# EAGLE schematic Step-to-TalkV2 (EAGLE 8.2.2)
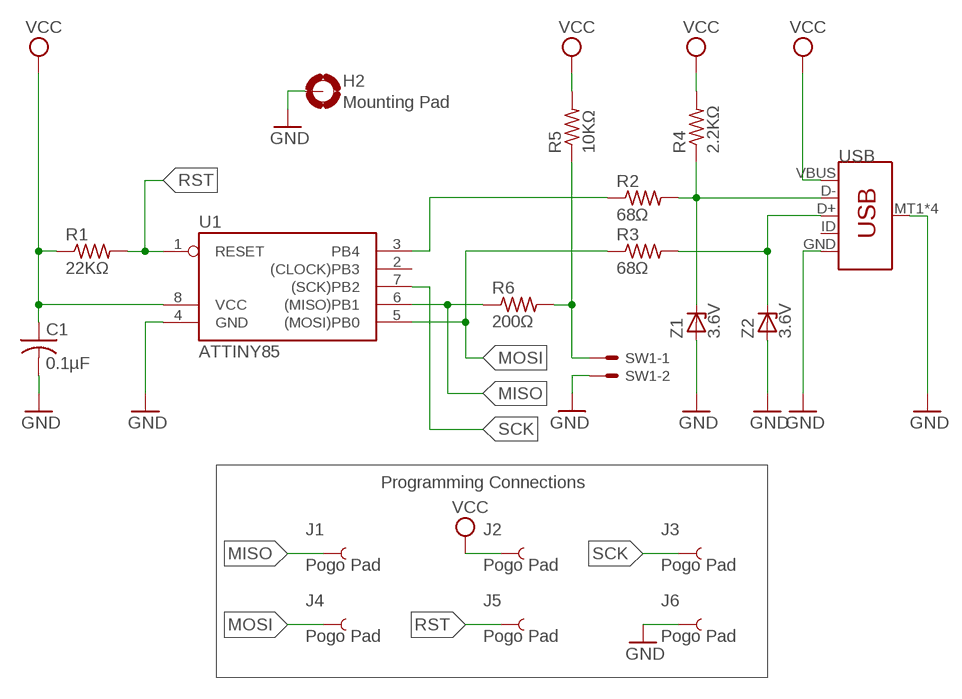
[diagram p0: schematic, sheet 1]

## Parts
C1  0.1µF  C-USC0603  [C0603]
H2  Mounting Pad  MOUNT-PAD-ROUND4.3  [4,3-PAD]
J1  Pogo Pad  TEST-POINT3  [PAD.03X.03]
J2  Pogo Pad  TEST-POINT3  [PAD.03X.03]
J3  Pogo Pad  TEST-POINT3  [PAD.03X.03]
J4  Pogo Pad  TEST-POINT3  [PAD.03X.03]
J5  Pogo Pad  TEST-POINT3  [PAD.03X.03]
J6  Pogo Pad  TEST-POINT3  [PAD.03X.03]
R1  22KΩ  R-US_R0603  [R0603]
R2  68Ω  R-US_R0603  [R0603]
R3  68Ω  R-US_R0603  [R0603]
R4  2.2KΩ  R-US_R0603  [R0603]
R5  10KΩ  R-US_R0603  [R0603]
R6  200Ω  R-US_R0603  [R0603]
SW1  87438-02  [87438-02]
U1  ATTINY85  TINY22S  [SOIC8]
USB  USB_MICRO-B_SMT  [USB-MICROB]
Z1  3.6V  PESD5V0X1UB  [SOD523]
Z2  3.6V  PESD5V0X1UB  [SOD523]

## Nets
D+: R3.2 USB.D+ Z2.1(K)
D-: R2.2 R4.1 USB.D- Z1.1(K)
GND: C1.2 H2.B4,3(MOUNT) J6.P$1 SW1.2 U1.4(GND) USB.GND USB.MT1(SHIELD) USB.MT2(SHIELD) USB.P$1(SHIELD) USB.P$2(SHIELD) Z1.2(A) Z2.2(A)
MISO: J1.P$1 R6.1 U1.6((MISO)PB1)
MOSI: J4.P$1 R3.1 U1.5((MOSI)PB0)
N$2: R2.1 U1.3(PB4)
N$4: R5.1 R6.2 SW1.1
RST: J5.P$1 R1.2 U1.1(RESET)
SCK: J3.P$1 U1.7((SCK)PB2)
VCC: C1.1 J2.P$1 R1.1 R4.2 R5.2 U1.8(VCC) USB.VBUS
Unconnected: U1.2((CLOCK)PB3) USB.ID

## Notes on the sheet
- Programming Connections

## Library data of the parts
C1 = adafruit:C-US: CAPACITOR, American symbol
H2 = holes:MOUNT-PAD-ROUND: MOUNTING PAD, round
J1-J6 = SparkFun-Connectors:TEST-POINT: SparkFun Test Points Bare copper test points for troubleshooting or In-Circuit-Testing. These are used by our Production team for verifying production board runs using pogo-pins on test beds. SparkFun Products: SparkFun LSM9DS1 Breakout <https://www.sparkfun.com/products/13284> SparkFun PSOC <https://www.sparkfun.com/products/13714> SparkFun Load Cell Amplifier <https://www.sparkfun.com/products/13879>
R1-R6 = adafruit:R-US_: RESISTOR, American symbol
SW1 = con-molex:87438-02: Wire-to-Board 1.50mm (.059") Pitch Header - Right Angle, SMT, Shrouded Source: http://www.molex.com/product/micro/87438.html; OC_FARNELL: 1711327; OC_NEWARK: unknown
U1 = atmel:TINY22: MICROCONTROLLER 1K ROM 128 bytes RAM 128 bytes EEPROM; OC_FARNELL: unknown; OC_NEWARK: unknown
USB = SparkFun-Connectors:USB_MICRO-B: USB Type Micro-B Connector Male/female and PTH/SMT variants SparkFun Products: SparkFun microB USB Breakout <https://www.sparkfun.com/products/12035> SparkFun USB microB Plug Breakout <https://www.sparkfun.com/products/10031> SparkFun ESP8266 Thing <https://www.sparkfun.com/products/13231>; PROD_ID: CONN-09505; SF_ID: PRT-08533
Z1 Z2 = NXP_60_26022015:PESD5V0X1UB: Ultra low capacitance unidirectional ESD protection diode Ultra low capacitance unidirectional ElectroStatic Discharge (ESD) protection diode in a SOD523 (SC-79) ultra small and flat lead Surface-Mounted Device (SMD) plastic package designed to protect one signal line from the damage caused by ESD and other transients. The combination of extremely low capacitance and ultra low clamping voltage makes the device ideal for high-speed data line protection applications. AAL Eindhoven MK